# Altium schematic sheet POWER.SchDoc
size A4; SheetNumber: 9; SheetTotal: 9
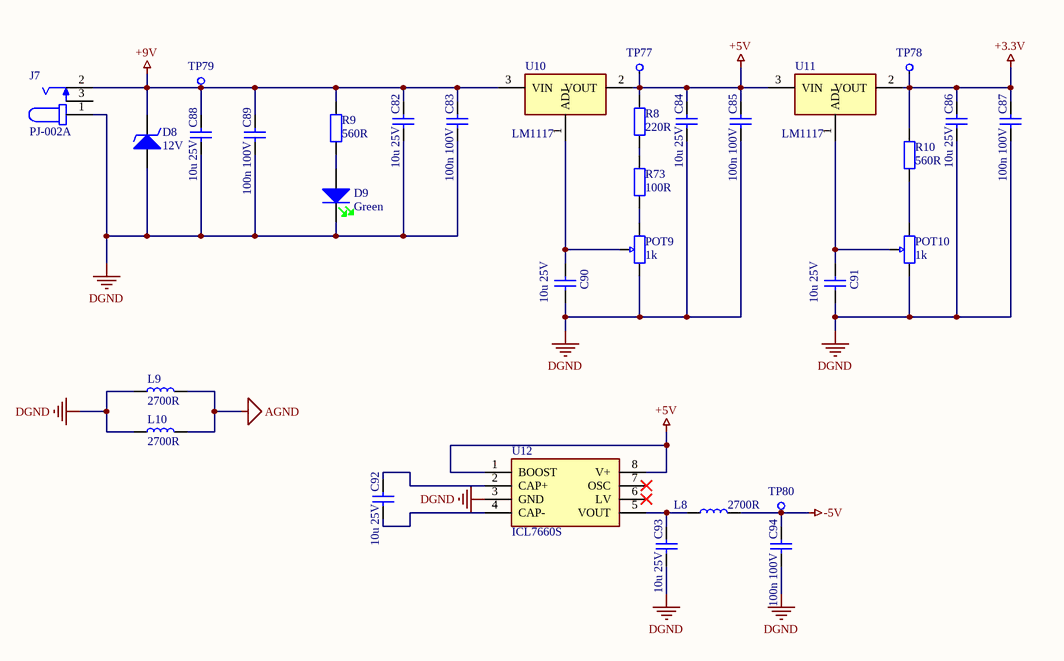
[diagram p0: POWER.SchDoc]

## Parts
C82  10u 25V  [CAPACITOR 0805]
C83  100n 100V  [CAPACITOR 0805]
C84  10u 25V  [CAPACITOR 0805]
C85  100n 100V  [CAPACITOR 0805]
C86  10u 25V  [CAPACITOR 0805]
C87  100n 100V  [CAPACITOR 0805]
C88  10u 25V  [CAPACITOR 0805]
C89  100n 100V  [CAPACITOR 0805]
C90  10u 25V  [CAPACITOR 0805]
C91  10u 25V  [CAPACITOR 0805]
C92  10u 25V  [CAPACITOR 0805]
C93  10u 25V  [CAPACITOR 0805]
C94  100n 100V  [CAPACITOR 0805]
D8  12V  [SOD-80 DO-231AA]
D9  Green  [LED 0805]
J7  PJ-002A  [Mechanical CUI_PJ-002A]
L8  2700R  [FERRITE 0805]
L9  2700R  [FERRITE 0805]
L10  2700R  [FERRITE 0805]
POT9  1k  [POTENTIOMETER TC33X]
POT10  1k  [POTENTIOMETER TC33X]
R8  220R  [RESISTOR 0805]
R9  560R  [RESISTOR 0805]
R10  560R  [RESISTOR 0805]
R73  100R  [RESISTOR 0805]
TP77  1mm  [TEST POINT 1MM]  (value not drawn)
TP78  1mm  [TEST POINT 1MM]  (value not drawn)
TP79  1mm  [TEST POINT 1MM]  (value not drawn)
TP80  1mm  [TEST POINT 1MM]  (value not drawn)
U10  LM1117  [TO-252]
U11  LM1117  [TO-252]
U12  ICL7660S  [SOIC-8]

## Nets
+3.3V: C86.2 C87.2 R10.2 TP78.1 U11.2(VOUT)
+5V: C84.2 C85.2 R8.2 TP77.1 U10.2(VOUT) U11.3(VIN) U12.1(BOOST) U12.8(V+)
+9V: C82.2 C83.2 C88.2 C89.2 D8.2 J7.2 R9.2 TP79.1 U10.3(VIN)
-5V: C94.2 L8.2 TP80.1
AGND: L9.2 L10.2
DGND: C82.1 C83.1 C84.1 C85.1 C86.1 C87.1 C88.1 C89.1 C90.1 C91.1 C93.1 C94.1 D8.1 D9.2 J7.1 L9.1 L10.1 POT9.1 POT10.1 U12.3(GND)
NetC90_2: C90.2 POT9.2 U10.1(ADJ)
NetC91_2: C91.2 POT10.2 U11.1(ADJ)
NetC92_1: C92.1 U12.4(CAP-)
NetC92_2: C92.2 U12.2(CAP+)
NetC93_2: C93.2 L8.1 U12.5(VOUT)
NetD9_1: D9.1 R9.1
NetPOT9_3: POT9.3 R73.1
NetPOT10_3: POT10.3 R10.1
NetR8_1: R8.1 R73.2

Not connected (* = marked no-connect by the designer): J7 3; U12 6(LV)* 7(OSC)*

## Library data of the parts
C82 C84 C86 C88 C90-C93 = Capacitor 10u 25V 10% X5R 0805: Capacitor: ceramic; MLCC; 10uF; 25V; X5R; ±10%; SMD; 0805; Manufacturer: MURATA; Manufacturer Part Number: GRM21BR61E106KA73K; ComponentLink1Description: Datasheet; ComponentLink1URL: https://www.tme.eu/Document/58bb7db4269ac3ad53d1aa3c0ade9bab/GRM.pdf; Footprint: Capacitor 0805; Price 10pcs [$]: 0.0784; Supplier: TME
C83 C85 C87 C89 C94 = Capacitor 100n 100V 10% X7R 0805: Capacitor: ceramic; MLCC; 100nF; 100V; X7R; ±10%; SMD; 0805; Manufacturer: YAGEO; Manufacturer Part Number: CC0805KKX7R0BB104; ComponentLink1Description: Datasheet; ComponentLink1URL: https://www.tme.eu/Document/fbb9415081fcefba62c0f8bbf5b21210/UPY-GPHC_X7R_6.3V-to-50V_20.pdf; Footprint: Capacitor 0805; Price 10pcs [$]: 0.0770; Supplier: TME
D8 = Diode 12V 0.5W SOD80 Zener BZT55C1: Zener Diodes 12 Volt 0.5W 5%; Manufacturer: Vishay Semiconductors; Manufacturer Part Number: BZT55C12; Price 10pcs [$]: 0.186; Supplier: Mouser; ComponentLink1Description: Datasheet; ComponentLink1URL: https://www.mouser.pl/datasheet/2/427/bzt55-1767542.pdf
D9 = Diode LED Green 0805 SMD 20mA: Standard LEDs - SMD WL-SMCW SMDMono TpVw Waterclr 0805 Green; Manufacturer: Wurth Elektronik; Manufacturer Part Number: 150080GS75000; Price 10pcs [$]: 0.192; Supplier: Mouser; ComponentLink1Description: Datasheet; ComponentLink1URL: https://www.mouser.pl/datasheet/2/445/150080GS75000-3084983.pdf
J7 = Mechanical DC Power Connectors Power Jacks: DC Power Connectors Power Jacks; Manufacturer Part Number: PJ-002A; Manufacturer: https://pl.mouser.com/datasheet/2/670/pj_002a-1778764.pdf; Footprint: 2 mm x 6.5 mm; Type: THT; Datasheet: https://pl.mouser.com/datasheet/2/670/pj_002a-1778764.pdf
L8-L10 = Inductor Ferrite Bead 2700Ω 0805 0.2A: Ferrite: bead; 2700Ω; SMD; 200mA; 0805; -55÷125°C; Manufacturer: MURATA; Manufacturer Part Number: BLM21BD272SN1L; ComponentLink1Description: Datasheet; ComponentLink1URL: https://www.tme.eu/Document/c9c44cce174b2958868ee1fe8b54450c/BLM21B222SPT-DTE.pdf; Price 10pcs [$]: 0.11; Supplier: TME
POT9 POT10 = Potentiometer PCB 1k SMD TC33X-1-102E: Trimmer Resistors - SMD TRIMMER-3MM OPEN FRAME; Manufacturer: Bourns; ComponentLink1Description: Datasheet; ComponentLink1URL: https://www.mouser.pl/datasheet/2/54/tc33-778219.pdf; Manufacturer Part Number: TC33X-1-102E; Price 10pcs [$]: 0.275; Supplier: Mouser
R8 = Resistor 220R 1% 1/8W 0805: Resistor: thick film; SMD; 0805; 220Ω; 0.125W; ±1%; -55÷155°C; Manufacturer: Yageo; Manufacturer Part Number: RC0805FR-07220R; ComponentLink1Description: Datasheet; ComponentLink1URL: https://www.tme.eu/Document/7b8fed8c112f8a94930279c22c957f7f/rc0805yageo.pdf; Footprint: Resistor 0805; Price 10pcs [$]: 0.023; Supplier: TME
R9 R10 = Resistor 560R 1% 1/8W 0805: Resistor: thick film; SMD; 0805; 560Ω; 0.125W; ±1%; -55÷155°C; Manufacturer: Yageo; Manufacturer Part Number: RC0805FR-07560R; ComponentLink1Description: Datasheet; ComponentLink1URL: https://www.tme.eu/Document/7b8fed8c112f8a94930279c22c957f7f/rc0805yageo.pdf; Footprint: Resistor 0805; Price 10pcs [$]: 0.023; Supplier: TME
R73 = Resistor 100R 1% 1/8W 0805: Resistor: thick film; SMD; 0805; 100Ω; 0.125W; ±1%; -55÷155°C; Manufacturer: Yageo; Manufacturer Part Number: RC0805FR-07100R; ComponentLink1Description: Datasheet; ComponentLink1URL: https://www.tme.eu/Document/7b8fed8c112f8a94930279c22c957f7f/rc0805yageo.pdf; Footprint: Resistor 0805; Price 10pcs [$]: 0.023; Supplier: TME
TP77-TP80 = Mechanical Test Point 1mm: Tesp Point 1mm; ComponentLink1Description: Datasheet; ComponentLink1URL: -; Manufacturer: -; Manufacturer Part Number: -; Footprint: -; Price 10pcs [$]: -; Supplier: -
U10 U11 = IC LDO ADJ 800mA TO-252 LM1117DT-ADJ: LDO Voltage Regulators 800MA LDO LINEAR REG; Manufacturer: Texas Instruments; Manufacturer Part Number: LM1117DT-ADJ; Price 10pcs [$]: 1.72; Supplier: Mouser; ComponentLink1Description: Datasheet; ComponentLink1URL: https://www.ti.com/general/docs/suppproductinfo.tsp?distId=26&gotoUrl=https://www.ti.com/lit/gpn/lm1117
U12 = IC Switching Voltage Regulators ICL7660S SOIC-8: Switching Voltage Regulators ICL7660SCBA; Manufacturer: Renesas / Intersil; Manufacturer Part Number: ICL7660SCBAZ-T; ComponentLink1Description: Datasheet; ComponentLink1URL: https://www.tme.eu/Document/9e9bea3f282501bfff2cea822a15d693/icl7660s-icl7660a.pdf; Price 10pcs [$]: 2.20; Supplier: TME